# Altium schematic sheet LTC.SchDoc
size A3; SheetNumber: 2; SheetTotal: 15; SheetDescription: LTC6813
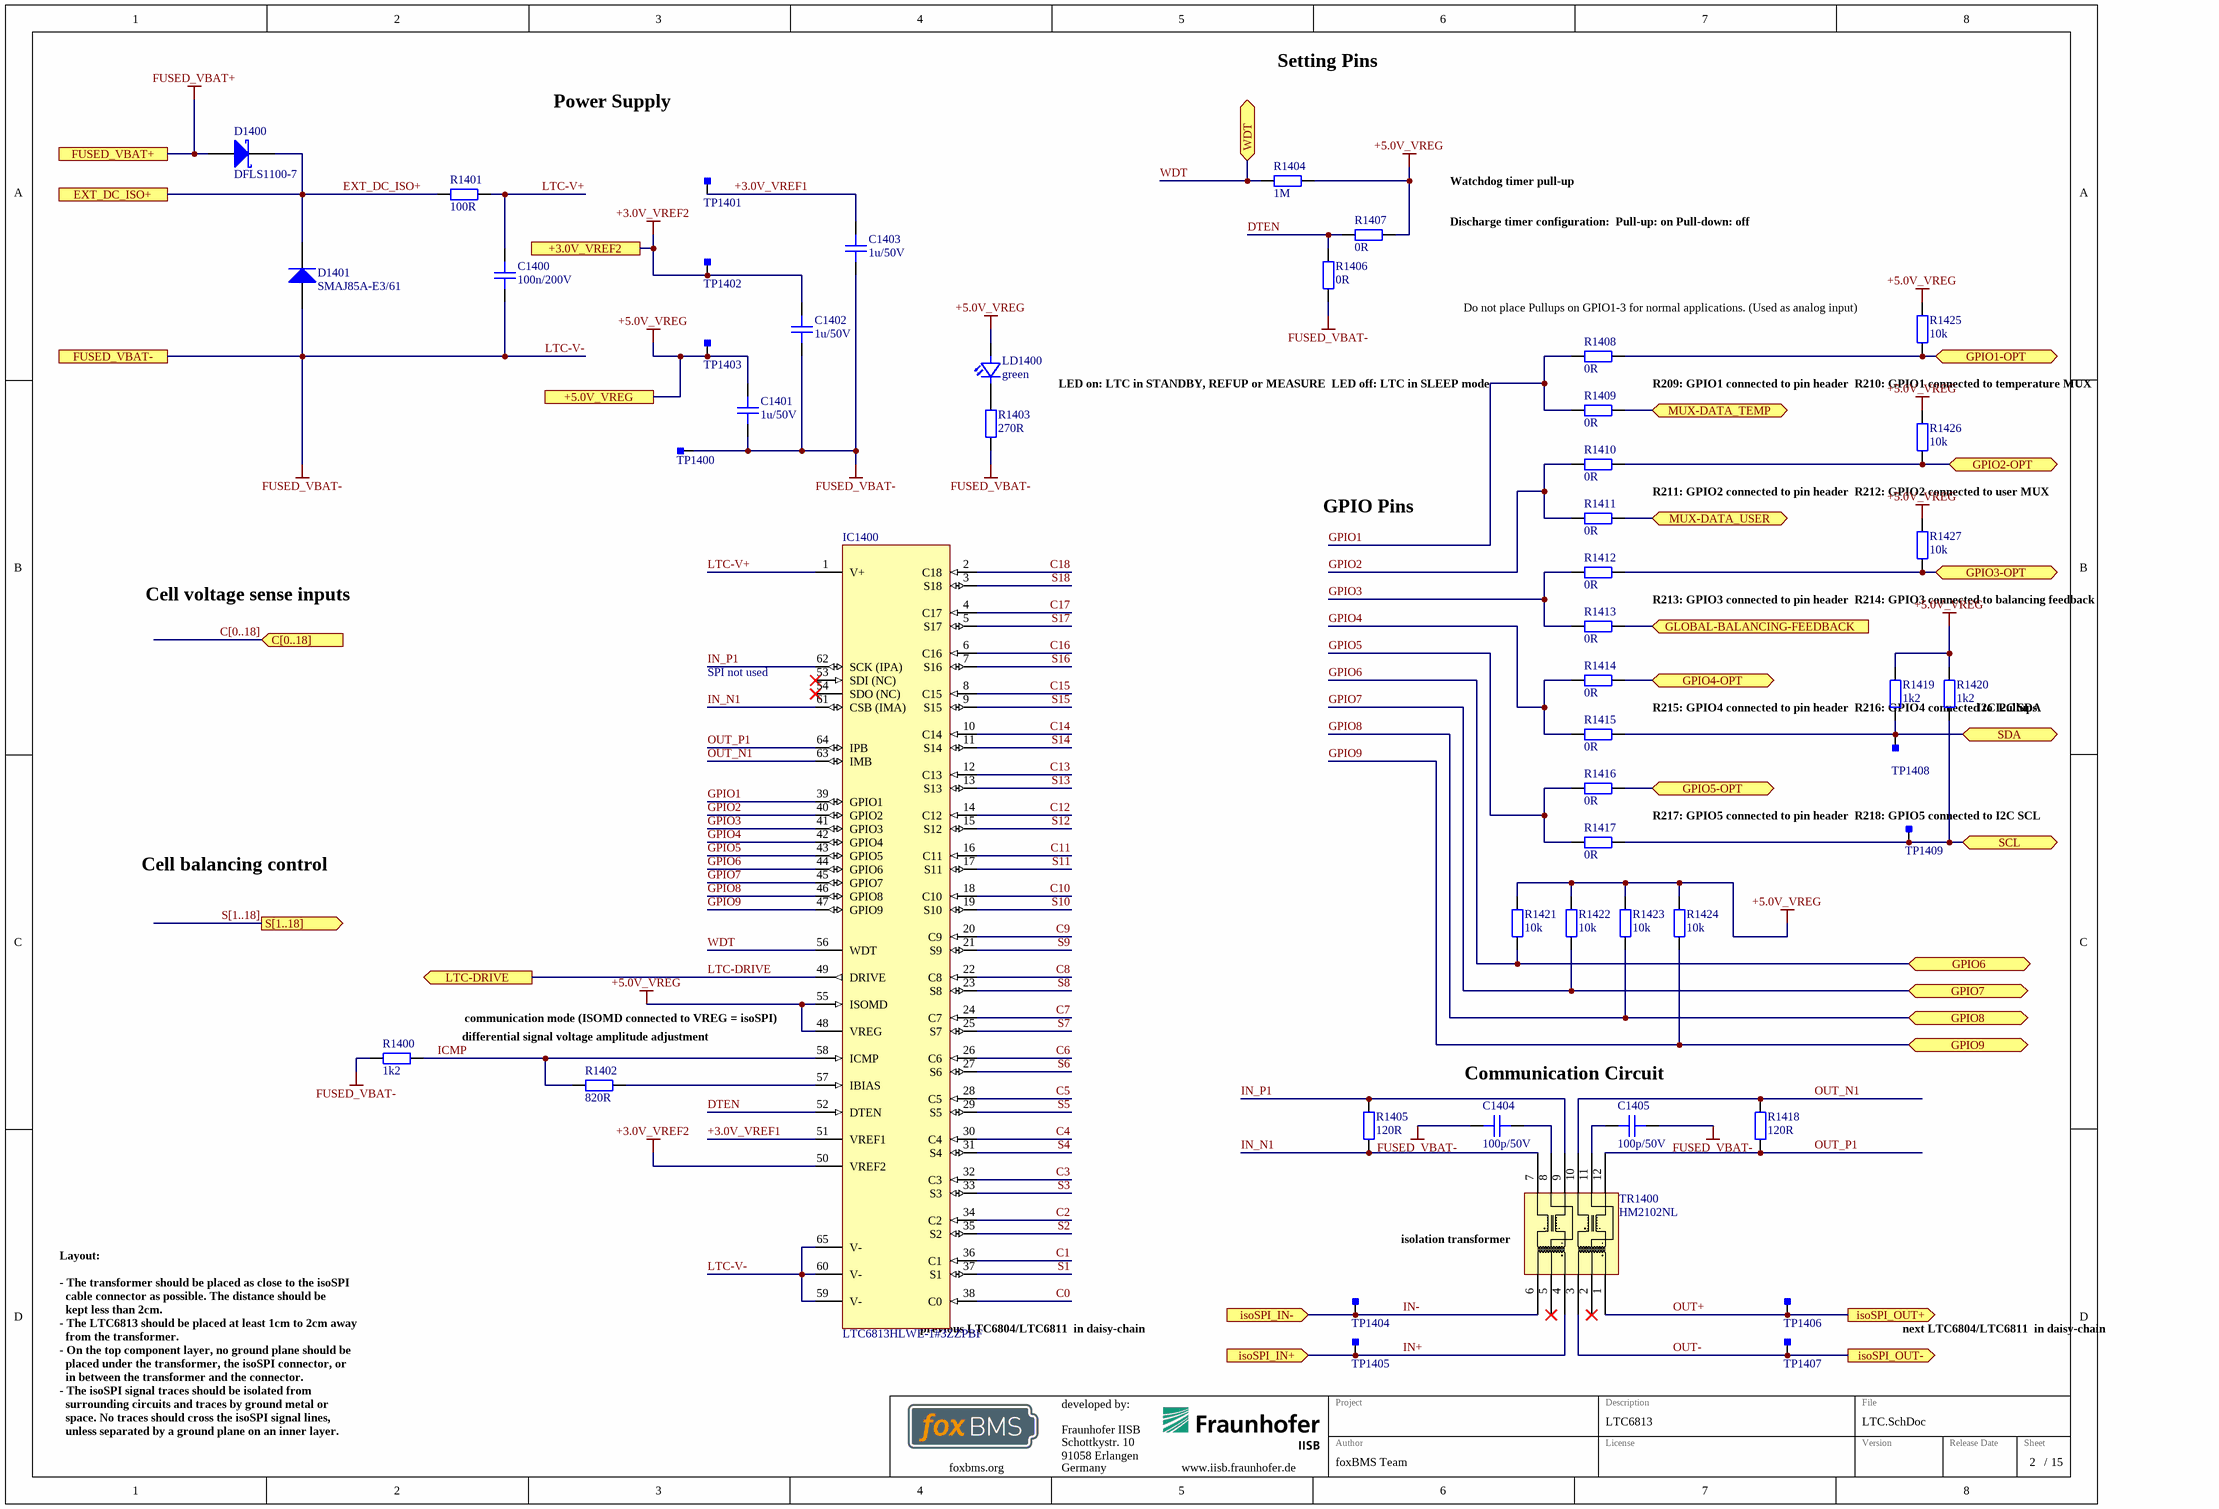
[diagram p0: LTC.SchDoc]

## Parts
C1400  100n/200V  [CAPC3216X18N]
C1401  1u/50V  [CAPC2012X14N]
C1402  1u/50V  [CAPC2012X14N]
C1403  1u/50V  [CAPC2012X14N]
C1404  100p/50V  [CAPC1608X08N]
C1405  100p/50V  [CAPC1608X08N]
D1400  DFLS1100-7  [DIOD-POWERDI123-2_V]
D1401  SMAJ85A-E3/61  [VISH-DO-214AC-2_L]
IC1400  LTC6813HLWE-1#3ZZPBF  [TSQFP50P1200X1200X160_HS-65N]
LD1400  green  [LEDC1608X07N]
R1400  1k2  [RESC1608X05N]
R1401  100R  [RESC2012X05N]
R1402  820R  [RESC1608X05N]
R1403  270R  [RESC1608X05N]
R1404  1M  [RESC1608X05N]
R1405  120R  [RESC1608X05N]
R1406  0R  [RESC1608X05N]
R1407  0R  [RESC1608X05N]
R1408  0R  [RESC1608X05N]
R1409  0R  [RESC1608X05N]
R1410  0R  [RESC1608X05N]
R1411  0R  [RESC1608X05N]
R1412  0R  [RESC1608X05N]
R1413  0R  [RESC1608X05N]
R1414  0R  [RESC1608X05N]
R1415  0R  [RESC1608X05N]
R1416  0R  [RESC1608X05N]
R1417  0R  [RESC1608X05N]
R1418  120R  [RESC1608X05N]
R1419  1k2  [RESC1608X05N]
R1420  1k2  [RESC1608X05N]
R1421  10k  [RESC1608X05N]
R1422  10k  [RESC1608X05N]
R1423  10k  [RESC1608X05N]
R1424  10k  [RESC1608X05N]
R1425  10k  [RESC1608X05N]
R1426  10k  [RESC1608X05N]
R1427  10k  [RESC1608X05N]
TP1400  Testpoint_Square  [Testpoint_S1]  (value not drawn)  (no BOM)
TP1401  Testpoint_Square  [Testpoint_S1]  (value not drawn)  (no BOM)
TP1402  Testpoint_Square  [Testpoint_S1]  (value not drawn)  (no BOM)
TP1403  Testpoint_Square  [Testpoint_S1]  (value not drawn)  (no BOM)
TP1404  Testpoint_Square  [Testpoint_S1]  (value not drawn)  (no BOM)
TP1405  Testpoint_Square  [Testpoint_S1]  (value not drawn)  (no BOM)
TP1406  Testpoint_Square  [Testpoint_S1]  (value not drawn)  (no BOM)
TP1407  Testpoint_Square  [Testpoint_S1]  (value not drawn)  (no BOM)
TP1408  Testpoint_Square  [Testpoint_S1]  (value not drawn)  (no BOM)
TP1409  Testpoint_Square  [Testpoint_S1]  (value not drawn)  (no BOM)
TR1400  HM2102NL  [HM2102NL]

## Ports
+3.0V_VREF2, +5.0V_VREG, C[0..18] (in), EXT_DC_ISO+, FUSED_VBAT+, FUSED_VBAT-, GLOBAL-BALANCING-FEEDBACK (in), GPIO1-OPT (bidir), GPIO2-OPT (bidir), GPIO3-OPT (bidir), GPIO4-OPT (bidir), GPIO5-OPT (bidir), GPIO6 (bidir), GPIO7 (bidir), GPIO8 (bidir), GPIO9 (bidir), isoSPI_IN+ (in), isoSPI_IN- (in), isoSPI_OUT+ (out), isoSPI_OUT- (out), LTC-DRIVE (out), MUX-DATA_TEMP (bidir), MUX-DATA_USER (bidir), S[1..18] (out), SCL (bidir), SDA (bidir), WDT (bidir)

## Nets
+3.0V_VREF2: C1402.2 IC1400.50(VREF2) TP1402.1 ; port +3.0V_VREF2
+5.0V_VREG: C1401.2 IC1400.48(VREG) IC1400.55(ISOMD) LD1400.2(A) R1404.2 R1407.2 R1419.2 R1420.2 R1421.2 R1422.2 R1423.2 R1424.2 R1425.2 R1426.2 R1427.2 TP1403.1 ; port +5.0V_VREG
FUSED_VBAT+: D1400.1(A) ; port FUSED_VBAT+
LTC-V-: C1400.2 C1401.1 C1402.1 C1403.1 C1404.1 C1405.1 D1401.2(A) IC1400.59(V-) IC1400.60(V-) IC1400.65(V-) R1400.1 R1403.1 R1406.1 TP1400.1 ; port FUSED_VBAT-  [also labelled FUSED_VBAT-]
+3.0V_VREF1: C1403.2 IC1400.51(VREF1) TP1401.1
C0: IC1400.38(C0)
C1: IC1400.36(C1)
C2: IC1400.34(C2)
C3: IC1400.32(C3)
C4: IC1400.30(C4)
C5: IC1400.28(C5)
C6: IC1400.26(C6)
C7: IC1400.24(C7)
C8: IC1400.22(C8)
C9: IC1400.20(C9)
C10: IC1400.18(C10)
C11: IC1400.16(C11)
C12: IC1400.14(C12)
C13: IC1400.12(C13)
C14: IC1400.10(C14)
C15: IC1400.8(C15)
C16: IC1400.6(C16)
C17: IC1400.4(C17)
C18: IC1400.2(C18)
DTEN: IC1400.52(DTEN) R1406.2 R1407.1
EXT_DC_ISO+: D1400.2(K) D1401.1(K) R1401.1 ; port EXT_DC_ISO+
GLOBAL-BALANCING-FEEDBACK: R1413.1 ; port GLOBAL-BALANCING-FEEDBACK
GPIO1: IC1400.39(GPIO1) R1408.2 R1409.2
GPIO1-OPT: R1408.1 R1425.1 ; port GPIO1-OPT
GPIO2: IC1400.40(GPIO2) R1410.2 R1411.2
GPIO2-OPT: R1410.1 R1426.1 ; port GPIO2-OPT
GPIO3: IC1400.41(GPIO3) R1412.2 R1413.2
GPIO3-OPT: R1412.1 R1427.1 ; port GPIO3-OPT
GPIO4: IC1400.42(GPIO4) R1414.2 R1415.2
GPIO4-OPT: R1414.1 ; port GPIO4-OPT
GPIO5: IC1400.43(GPIO5) R1416.2 R1417.2
GPIO5-OPT: R1416.1 ; port GPIO5-OPT
GPIO6: IC1400.44(GPIO6) R1421.1 ; port GPIO6
GPIO7: IC1400.45(GPIO7) R1422.1 ; port GPIO7
GPIO8: IC1400.46(GPIO8) R1423.1 ; port GPIO8
GPIO9: IC1400.47(GPIO9) R1424.1 ; port GPIO9
ICMP: IC1400.58(ICMP) R1400.2 R1402.1
IN+: TP1405.1 TR1400.4 ; port isoSPI_IN+
IN-: TP1404.1 TR1400.6 ; port isoSPI_IN-
IN_N1: IC1400.61(CSB_(IMA)) R1405.2 TR1400.7
IN_P1: IC1400.62(SCK_(IPA)) R1405.1 TR1400.9
LTC-DRIVE: IC1400.49(DRIVE) ; port LTC-DRIVE
LTC-V+: C1400.1 IC1400.1(V+) R1401.2
MUX-DATA_TEMP: R1409.1 ; port MUX-DATA_TEMP
MUX-DATA_USER: R1411.1 ; port MUX-DATA_USER
OUT+: TP1406.1 TR1400.1 ; port isoSPI_OUT+
OUT-: TP1407.1 TR1400.3 ; port isoSPI_OUT-
OUT_N1: IC1400.63(IMB) R1418.2 TR1400.10
OUT_P1: IC1400.64(IPB) R1418.1 TR1400.12
S1: IC1400.37(S1)
S2: IC1400.35(S2)
S3: IC1400.33(S3)
S4: IC1400.31(S4)
S5: IC1400.29(S5)
S6: IC1400.27(S6)
S7: IC1400.25(S7)
S8: IC1400.23(S8)
S9: IC1400.21(S9)
S10: IC1400.19(S10)
S11: IC1400.17(S11)
S12: IC1400.15(S12)
S13: IC1400.13(S13)
S14: IC1400.11(S14)
S15: IC1400.9(S15)
S16: IC1400.7(S16)
S17: IC1400.5(S17)
S18: IC1400.3(S18)
SCL: R1417.1 R1420.1 TP1409.1 ; port SCL
SDA: R1415.1 R1419.1 TP1408.1 ; port SDA
WDT: IC1400.56(WDT) R1404.1 ; port WDT
NetC1404_2: C1404.2 TR1400.8
NetC1405_2: C1405.2 TR1400.11
NetIC1400_57: IC1400.57(IBIAS) R1402.2
NetLD1400_1: LD1400.1(C) R1403.2

Not connected (* = marked no-connect by the designer): IC1400 53(SDI_(NC))* 54(SDO_(NC))*; TR1400 2* 5*

## Buses and harness runs
bus C[0..18] = port C[0..18]
bus S[1..18] = port S[1..18]

## Notes on the sheet
- Power Supply
- Setting Pins
- Watchdog timer pull-up
- Discharge timer configuration:
  Pull-up: on
  Pull-down: off
- (near R1425) Do not place Pullups on GPIO1-3 for normal applications. (Used as analog input)
- LED on: LTC in STANDBY, REFUP or MEASURE
  LED off: LTC in SLEEP mode
- R209: GPIO1 connected to pin header
  R210: GPIO1 connected to temperature MUX
- GPIO Pins
- R211: GPIO2 connected to pin header
  R212: GPIO2 connected to user MUX
- Cell voltage sense inputs
- R213: GPIO3 connected to pin header
  R214: GPIO3 connected to balancing feedback
- SPI not used
- R215: GPIO4 connected to pin header
  R216: GPIO4 connected to I2C SDA
- (near R1420) I2C Pullups
- (near TP1409) R217: GPIO5 connected to pin header
  R218: GPIO5 connected to I2C SCL
- Cell balancing control
- communication mode (ISOMD connected to VREG = isoSPI)
- differential signal voltage amplitude adjustment
- Communication Circuit
- (near TR1400) isolation transformer
- (near TP1405) previous LTC6804/LTC6811
  in daisy-chain
- next LTC6804/LTC6811
  in daisy-chain
- Layout:
  - The transformer should be placed as close to the isoSPI
  cable connector as possible. The distance should be
  kept less than 2cm.
  - The LTC6813 should be placed at least 1cm to 2cm away
  from the transformer.
  - On the top component layer, no ground plane should be
  placed under the transformer, the isoSPI connector, or
  in between the transformer and the connector.
  - The isoSPI signal traces should be isolated from
  surrounding circuits and traces by ground metal or
  space. No traces should cross the isoSPI signal lines,
  unless separated by a ground plane on an inner layer.
- Fraunhofer IISB
- Schottkystr. 10
- developed by:
- 91058 Erlangen
- Germany
- Author
- Project
- License
- Description
- File
- Version
- Release Date
- Sheet
- foxbms.org <https://foxbms.org>
- www.iisb.fraunhofer.de <https://www.iisb.fraunhofer.de/>
- foxBMS Team
- /

## Library data of the parts
C1400 = gen_C_ceramic_100n_200V_X7R_1206: MLCC; Capacitance: 100n; Rated Voltage: 200V; Dielectric: X7R; Case EIA: 1206; Case Metric: 3216; Automotive Qualified: True; Part Number: gen_C_ceramic_100n_200V_X7R_1206; Supplier 1: Farnell; Supplier Part Number 1: 2673161; Supplier 2: Farnell; Supplier Part Number 2: 2520773
C1401-C1403 = gen_C_ceramic_1u_50V_X7R_0805: MLCC; Capacitance: 1u; Rated Voltage: 50V; Dielectric: X7R; Case EIA: 0805; Case Metric: 2012; Automotive Qualified: True; Tolerance: ± 10%; AVT Set: x; Part Number: gen_C_ceramic_1u_50V_X7R_0805; Supplier 1: Farnell; Supplier Part Number 1: 2672199; Operating Temperature: -55°C - +125°C; Supplier 2: Farnell; Supplier Part Number 2: 2479894; Supplier 3: Farnell; Supplier Part Number 3: 2464630
C1404 C1405 = gen_C_ceramic_100p_50V_C0G_0603: MLCC; Capacitance: 100p; Rated Voltage: 50V; Dielectric: C0G; Case EIA: 0603; Case Metric: 1608; Automotive Qualified: True; Tolerance: ± 10%; Part Number: gen_C_ceramic_100p_50V_C0G_0603; Supplier 1: Farnell; Supplier Part Number 1: 2478236
D1400 = CMP-2000-05099-1: 1 A High Voltage Schottky Barrier Rectifier, 0.62 V, -55 to 175 degC, 2- Pin POWERDI123, Pb-Free, Tape and Reel; Manufacturer: Diodes Inc; Average Rectified Current-Max: 1A; Peak Current-Max: 40A; Forward Voltage: 0.77V; Reverse Current-Max: 1µA; Reverse Voltage-Max [Vrrm]: 100V; Datasheet Version: Sep-14; Datasheet URL: https://datasheet.ciiva.com/15144/getdatasheetpartid-44146-15144126.pdf; Manufacturer URL: http://www.diodes.com/
D1401 = CMP-0548-00243-2: Transient Voltage Suppressor, 6.40 to 231 V, 85 V Stand-off Voltage, Uni-Directional, -55 to 155 degC, 2-pin DO-214AC, Pb-Free, Tape and Reel; Manufacturer: Vishay Semiconductor; VWM (V): 85; PPPM (W): 400, 300; VBR Uni-Directional (V): 6.4 to 231; IFSM: 40 A; ID (uA): 1; RoHS: TRUE; ComponentLink3Description: Package Specification; PackageReference: DO-214AC-2; PartNumber: SMAJ85A-E3/61; ComponentLink2Description: Datasheet; ComponentLink2URL: http://www.vishay.com/docs/88390/smaj50a.pdf; ComponentLink3URL: http://www.vishay.com/docs/88390/smaj50a.pdf; Packing: Tape and Reel; ComponentLink1Description: Manufacturer URL; PackageDescription: 2-Pin DO-214AC (SMA), Body 4.245 x 2.665 mm; DatasheetVersion: 12/8/2013; ComponentLink1URL: http://www.vishay.com/; Operating Junction and Storage Temperature Range: -55 to 150 degC; Mounting Technology: Surface Mount
IC1400 = LTC6813HLWE-1#3ZZPBF: 18 Cell Multicell Battery Monitor, -40 to 125 degC, Pb-Free; PartNumber: LTC6811HG-1#PBF; Manufacturer: Linear Technology; Type of Charger: Battery Stack Monitor; Vin Max(V): 60; Battery Chemistry: Li-Ion, Li-Polymer, NiMH; Number of Cells: > 1000 V of stacked Li-Ion cells; Automotive Qualified: True; PnP Package: QFP-64; RoHS: TRUE; ComponentLink1Description: Datasheet; ComponentLink1URL: http://www.linear.com/docs/59387; PackageReference: G-48; PackageVersion: Rev. Ã˜, 01/2011; ComponentLink2Description: Datasheet; Mounting Technology: Surface Mount; ComponentLink3Description: Package Specification; PackageDescription: 48-Pin Plastic SSOP, Body 12.8 x 5.3 mm, Pitch 0.5 mm; ComponentLink3URL: http://cds.linear.com/docs/en/packaging/05081887_0_G48.pdf; ComponentLink2URL: http://cds.linear.com/docs/en/datasheet/680412f.pdf; Part Number: LTC6813HLWE-1#3ZZPBF; Part Name: LTC6813HLWE-1#3ZZPBF; Operating Temperature: -40°C - +125°C; Supplier 1: Digikey; Supplier Part Number 1: LTC6813HLWE-1#3ZZPBF-ND
LD1400 = LED_0603_green_AECQ: TLMG1100-GS08; Manufacturer: Vishay; Breakdown Voltage: 5V; Continuous Forward Current: 20mA; Forward Voltage @ 20mA: 2.1V; Automotive Qualified: True; Part Number: LED_0603_green_AECQ; Color: green; Supplier 1: Farnell; Supplier Part Number 1: 2293494; PnP Package: LED_0603; Operating Temperature: -40°C - 100°C; ComponentLink1Description: Datasheet; ComponentLink1URL: http://www.farnell.com/datasheets/2049164.pdf; Supplier 2: Digikey; Supplier Part Number 2: 751-1165-1-ND
R1400 R1419 R1420 = gen_R_1k2_0603: SMD Resistor 1k2 0603; Tolerance: 1%; Power: 0.1W; Case EIA: 0603; Case Metric: 1608; Maximum Working Voltage: 75V; PnP Package: R_0603; Automotive Qualified: True; Part Number: gen_R_1k2_0603; Operating Temperature: -55°C - +155°C; Resistance: 1k2; Series: E24; PnP Value: 1k2; Supplier 1: Farnell; Supplier Part Number 1: 2073370
R1401 = gen_R_100R_0805: SMD Resistor 100R 0805; Tolerance: 1%; Power: 0.125W; Case EIA: 0805; Case Metric: 2012; Maximum Working Voltage: 150V; PnP Package: R_0805; Automotive Qualified: True; Part Number: gen_R_100R_0805; Operating Temperature: -55°C - +155°C; Resistance: 100R; Series: E24, E96; PnP Value: 100R; Supplier 1: Farnell; Supplier Part Number 1: 1469862
R1402 = gen_R_820R_0603: SMD Resistor 820R 0603; Tolerance: 1%; Power: 0.1W; Case EIA: 0603; Case Metric: 1608; Maximum Working Voltage: 75V; PnP Package: R_0603; Automotive Qualified: True; Part Number: gen_R_820R_0603; Operating Temperature: -55°C - +155°C; Resistance: 820R; Series: E24; PnP Value: 820R; Supplier 1: Farnell; Supplier Part Number 1: 1469841
R1403 = gen_R_270R_0603: SMD Resistor 270R 0603; Tolerance: 1%; Power: 0.1W; Case EIA: 0603; Case Metric: 1608; Maximum Working Voltage: 75V; PnP Package: R_0603; Automotive Qualified: True; Part Number: gen_R_270R_0603; Operating Temperature: -55°C - +155°C; Resistance: 270R; Series: E24; PnP Value: 270R; Supplier 1: Farnell; Supplier Part Number 1: 2141320
R1404 = gen_R_1M_0603: SMD Resistor 1M 0603; Tolerance: 1%; Power: 0.1W; Case EIA: 0603; Case Metric: 1608; Maximum Working Voltage: 75V; PnP Package: R_0603; Automotive Qualified: True; Part Number: gen_R_1M_0603; Operating Temperature: -55°C - +155°C; Resistance: 1M; Series: E24, E96; PnP Value: 1M; Supplier 1: Farnell; Supplier Part Number 1: 1469746
R1405 R1418 = gen_R_120R_0603: SMD Resistor 120R 0603; Tolerance: 1%; Power: 0.1W; Case EIA: 0603; Case Metric: 1608; Maximum Working Voltage: 75V; PnP Package: R_0603; Automotive Qualified: True; Part Number: gen_R_120R_0603; Operating Temperature: -55°C - +155°C; Resistance: 120R; Series: E24; PnP Value: 120R; Supplier 1: Farnell; Supplier Part Number 1: 1652832
R1406-R1417 = gen_R_0R_0603: SMD Resistor 0R 0603; Power: 0.1W; Case EIA: 0603; Case Metric: 1608; Maximum Working Voltage: 75V; PnP Package: R_0603; Automotive Qualified: True; Part Number: gen_R_0R_0603; Operating Temperature: -55°C - +155°C; Resistance: 0R; Series: Jumper; PnP Value: 0R; Supplier 1: Farnell; Supplier Part Number 1: 2616580
R1421-R1427 = gen_R_10k_0603: SMD Resistor 10k 0603; Tolerance: 1%; Power: 0.1W; Case EIA: 0603; Case Metric: 1608; Maximum Working Voltage: 75V; PnP Package: R_0603; Automotive Qualified: True; Part Number: gen_R_10k_0603; Operating Temperature: -55°C - +155°C; Resistance: 10k; Series: E24, E96; PnP Value: 10k; Supplier 1: Farnell; Supplier Part Number 1: 2073349
TP1400-TP1409 = Testpoint_Square: Testpoint, square; Part Number: Testpoint_Square
TR1400 = HM2102NL: Pulse HM2102NL BMS Transformer; Automotive Qualified: True; Part Number: HM2102NL; Manufacturer: Pulse; Operating Temperature: -40°C - +125°C; ComponentLink1Description: Datasheet; ComponentLink1URL: https://www.mouser.com/ds/2/336/HM2102NL-1218600.pdf; Supplier 1: Mouser; Supplier Part Number 1: 673-HM2102NL; Supplier 2: Digikey; Supplier Part Number 2: 1840-1034-1-ND